# Altium schematic sheet ledstripes.SchDoc
size 209 x 148 mm; Organization: LieBtrau; DocumentNumber: 1; SheetNumber: 1; SheetTotal: 1
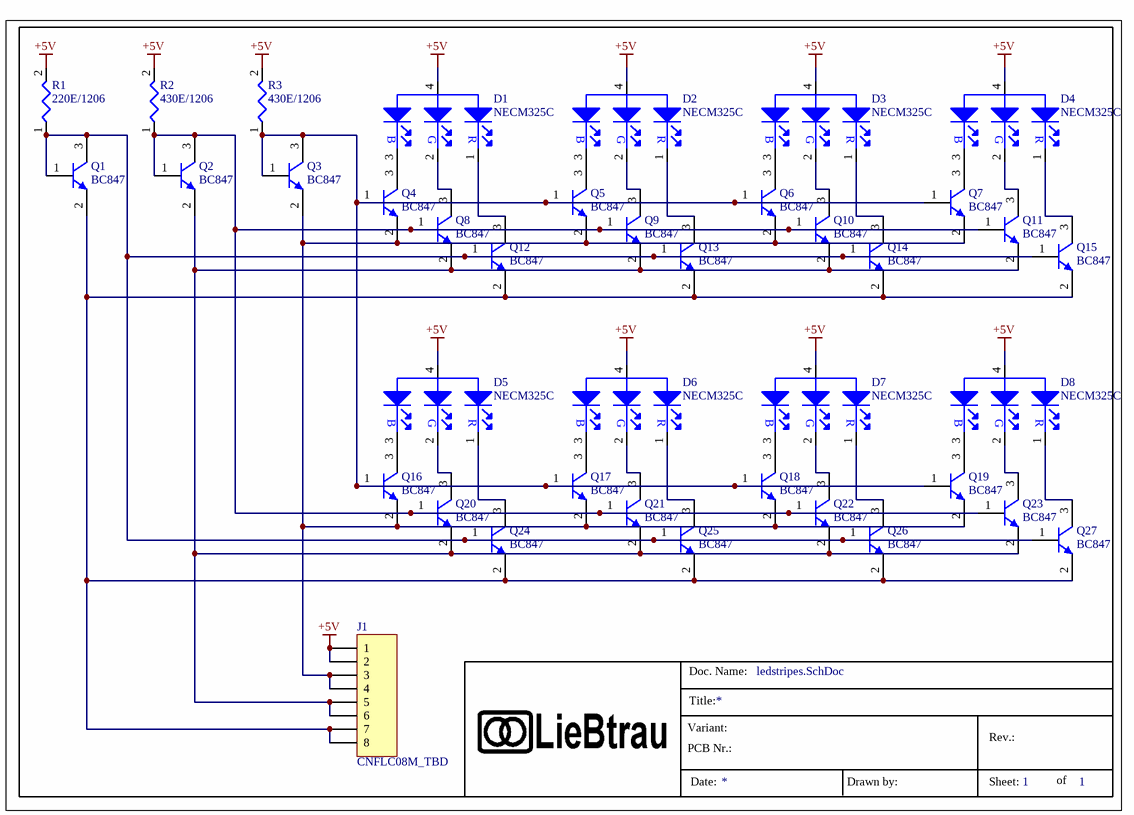
[diagram p0: ledstripes.SchDoc]

## Parts
D1  NECM325C  [D_PLCC4]
D2  NECM325C  [D_PLCC4]
D3  NECM325C  [D_PLCC4]
D4  NECM325C  [D_PLCC4]
D5  NECM325C  [D_PLCC4]
D6  NECM325C  [D_PLCC4]
D7  NECM325C  [D_PLCC4]
D8  NECM325C  [D_PLCC4]
J1  CNFLC08M_TBD  [J_215079-8]
Q1  BC847  [SOT23]
Q2  BC847  [SOT23]
Q3  BC847  [SOT23]
Q4  BC847  [SOT23]
Q5  BC847  [SOT23]
Q6  BC847  [SOT23]
Q7  BC847  [SOT23]
Q8  BC847  [SOT23]
Q9  BC847  [SOT23]
Q10  BC847  [SOT23]
Q11  BC847  [SOT23]
Q12  BC847  [SOT23]
Q13  BC847  [SOT23]
Q14  BC847  [SOT23]
Q15  BC847  [SOT23]
Q16  BC847  [SOT23]
Q17  BC847  [SOT23]
Q18  BC847  [SOT23]
Q19  BC847  [SOT23]
Q20  BC847  [SOT23]
Q21  BC847  [SOT23]
Q22  BC847  [SOT23]
Q23  BC847  [SOT23]
Q24  BC847  [SOT23]
Q25  BC847  [SOT23]
Q26  BC847  [SOT23]
Q27  BC847  [SOT23]
R1  220E/1206  [R_1206]
R2  430E/1206  [R_1206]
R3  430E/1206  [R_1206]

## Nets
+5V: D1.4(A) D2.4(A) D3.4(A) D4.4(A) D5.4(A) D6.4(A) D7.4(A) D8.4(A) J1.1 J1.2 R1.2 R2.2 R3.2
NetD1_1: D1.1(C) Q12.3(E)
NetD1_2: D1.2(C) Q8.3(E)
NetD1_3: D1.3(C) Q4.3(E)
NetD2_1: D2.1(C) Q13.3(E)
NetD2_2: D2.2(C) Q9.3(E)
NetD2_3: D2.3(C) Q5.3(E)
NetD3_1: D3.1(C) Q14.3(E)
NetD3_2: D3.2(C) Q10.3(E)
NetD3_3: D3.3(C) Q6.3(E)
NetD4_1: D4.1(C) Q15.3(E)
NetD4_2: D4.2(C) Q11.3(E)
NetD4_3: D4.3(C) Q7.3(E)
NetD5_1: D5.1(C) Q24.3(E)
NetD5_2: D5.2(C) Q20.3(E)
NetD5_3: D5.3(C) Q16.3(E)
NetD6_1: D6.1(C) Q25.3(E)
NetD6_2: D6.2(C) Q21.3(E)
NetD6_3: D6.3(C) Q17.3(E)
NetD7_1: D7.1(C) Q26.3(E)
NetD7_2: D7.2(C) Q22.3(E)
NetD7_3: D7.3(C) Q18.3(E)
NetD8_1: D8.1(C) Q27.3(E)
NetD8_2: D8.2(C) Q23.3(E)
NetD8_3: D8.3(C) Q19.3(E)
NetJ1_3: J1.3 J1.4 Q3.2(B) Q4.2(B) Q5.2(B) Q6.2(B) Q7.2(B) Q16.2(B) Q17.2(B) Q18.2(B) Q19.2(B)
NetJ1_5: J1.5 J1.6 Q2.2(B) Q8.2(B) Q9.2(B) Q10.2(B) Q11.2(B) Q20.2(B) Q21.2(B) Q22.2(B) Q23.2(B)
NetJ1_7: J1.7 J1.8 Q1.2(B) Q12.2(B) Q13.2(B) Q14.2(B) Q15.2(B) Q24.2(B) Q25.2(B) Q26.2(B) Q27.2(B)
NetQ1_1: Q1.1(C) Q1.3(E) Q12.1(C) Q13.1(C) Q14.1(C) Q15.1(C) Q24.1(C) Q25.1(C) Q26.1(C) Q27.1(C) R1.1
NetQ2_1: Q2.1(C) Q2.3(E) Q8.1(C) Q9.1(C) Q10.1(C) Q11.1(C) Q20.1(C) Q21.1(C) Q22.1(C) Q23.1(C) R2.1
NetQ3_1: Q3.1(C) Q3.3(E) Q4.1(C) Q5.1(C) Q6.1(C) Q7.1(C) Q16.1(C) Q17.1(C) Q18.1(C) Q19.1(C) R3.1

## Notes on the sheet
- Title:
- Doc. Name:
- Variant:
- PCB Nr.:
- Rev.:
- Date:
- Drawn by:
- Sheet:
- of
- (in symbol NECM325C) B; G; R

## Library data of the parts
D1-D8 = NECM325C: Manufacturer: Nichia; Part Number: NECM325C; Component Type: led
J1 = CNFLC08F_TBD: *; Order Code: Farnell 1641857; Part Number: CNFLC08F_TBD; Component Type: connector
Q1-Q27 = BC847: Amplifier Transistor NPN Silicon; Part Number: BC847; Component Type: transistor
R1 = YRES220_1206: Resistor; Manufacturer: Yageo (Phycomp); Order Code: Farnell 9240446; Part Number: YRES220_1206; Component Type: resistor
R2 R3 = YRES430E_TBD: Resistor; Manufacturer: Welwyn; Order Code: Farnell 1100182; Part Number: YRES430E_TBD; Component Type: resistor